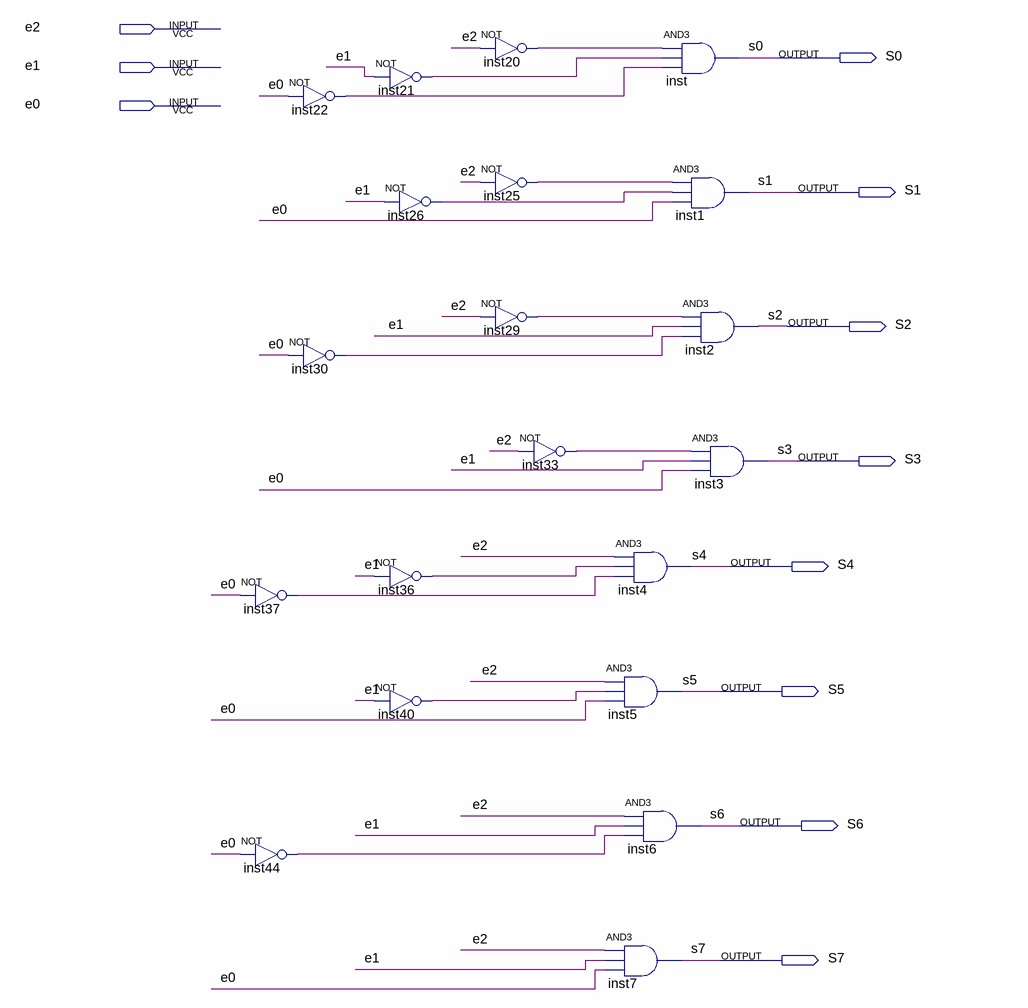
[diagram p0: schematic sheet]
// Quartus schematic abk_decod3x8.bdf as structural Verilog: 20 symbols, 11 pins
module abk_decod3x8 (
  input  e2,
  input  e1,
  input  e0,
  output S0,
  output S1,
  output S2,
  output S3,
  output S4,
  output S5,
  output S6,
  output S7
);

  wire inst20_out, inst21_out, inst22_out, inst25_out, inst26_out, inst29_out, inst30_out, inst33_out,
       inst36_out, inst37_out, inst40_out, inst44_out;

  not inst22 (inst22_out, e0);
  not inst30 (inst30_out, e0);
  not inst37 (inst37_out, e0);
  not inst44 (inst44_out, e0);
  not inst21 (inst21_out, e1);
  not inst36 (inst36_out, e1);
  not inst40 (inst40_out, e1);
  not inst26 (inst26_out, e1);
  not inst20 (inst20_out, e2);
  not inst25 (inst25_out, e2);
  not inst29 (inst29_out, e2);
  not inst33 (inst33_out, e2);
  and inst5 (S5, e2, inst40_out, e0);
  and inst7 (S7, e2, e1, e0);
  and inst (S0, inst20_out, inst21_out, inst22_out);
  and inst1 (S1, inst25_out, inst26_out, e0);
  and inst2 (S2, inst29_out, e1, inst30_out);
  and inst4 (S4, e2, inst36_out, inst37_out);
  and inst6 (S6, e2, e1, inst44_out);
  and inst3 (S3, inst33_out, e1, e0);
endmodule
